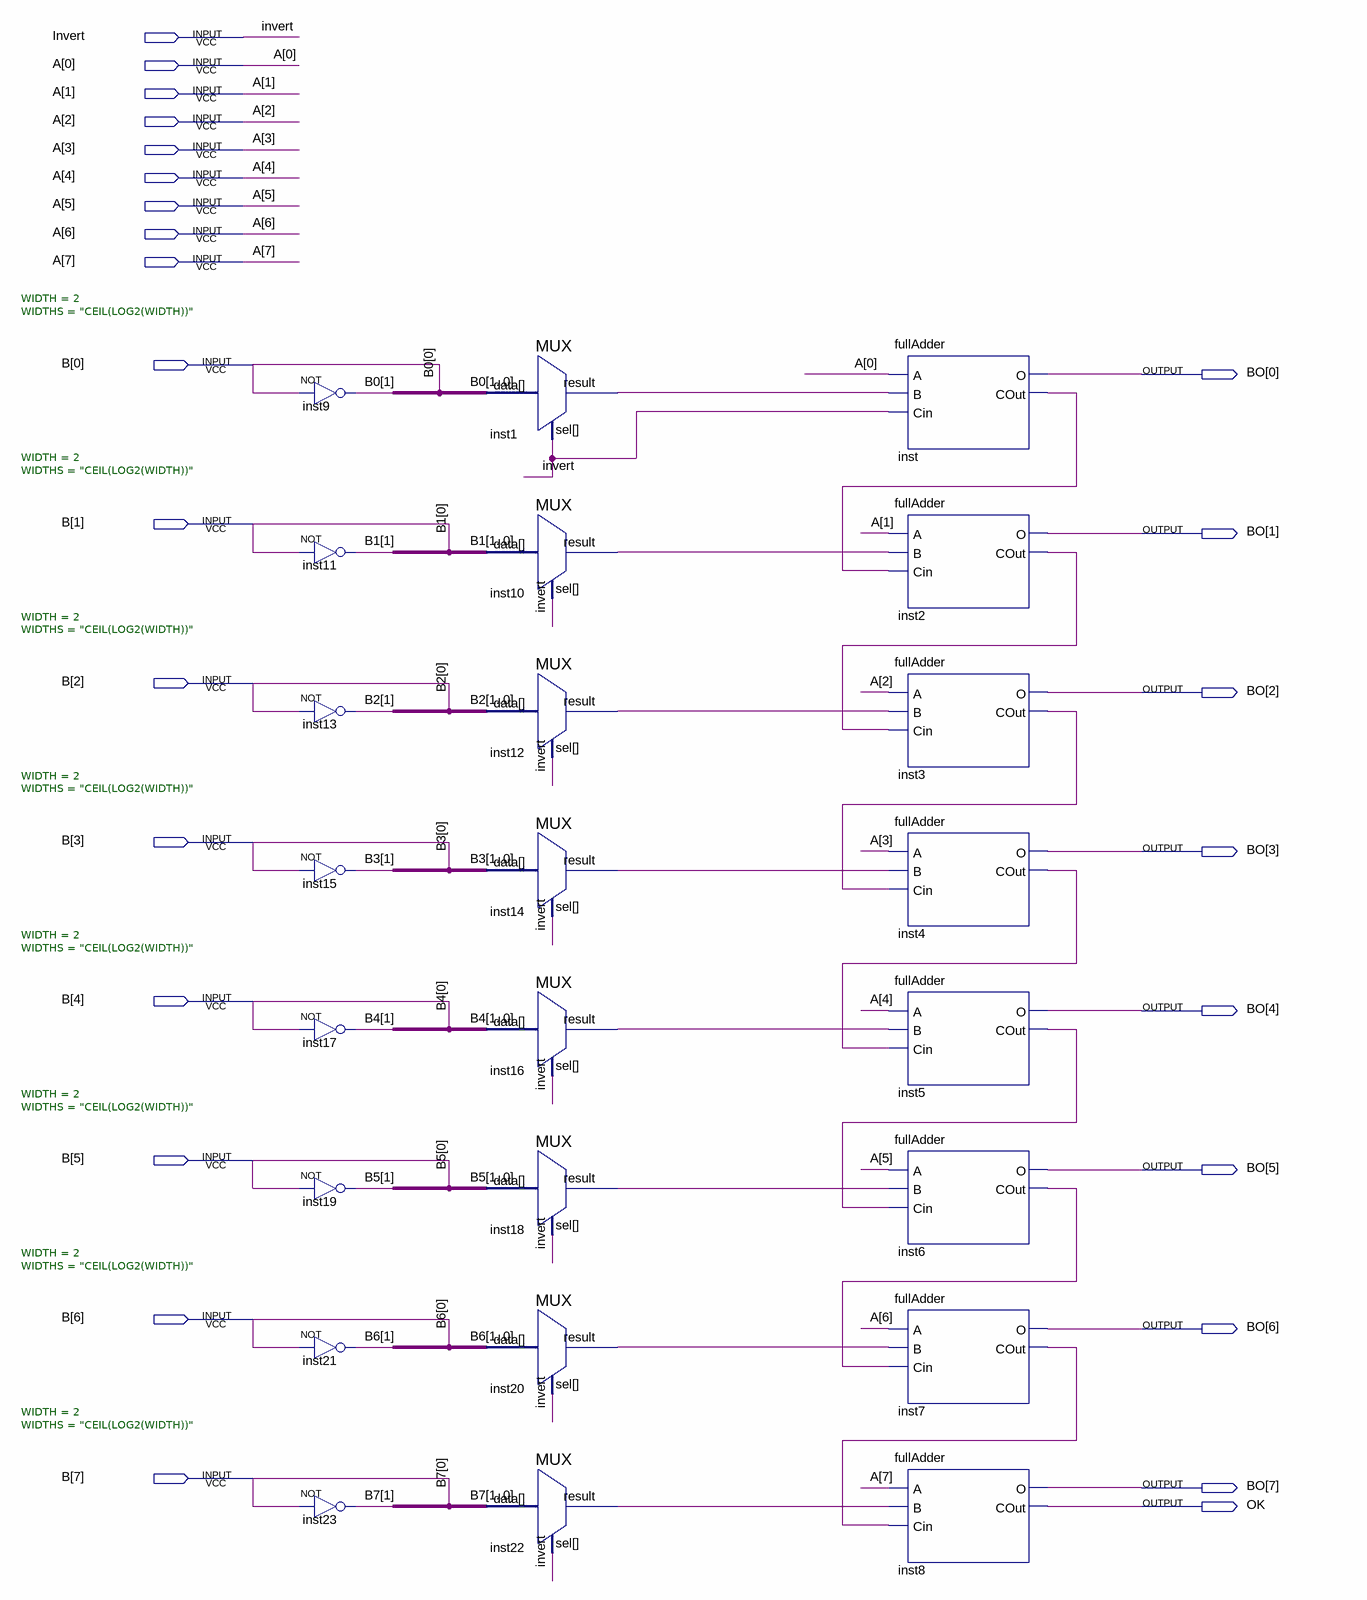
[diagram p0: schematic sheet]
// Quartus schematic ULA.bdf as structural Verilog: 24 symbols, 26 pins
module ULA (
  input  Invert,
  input  [7:0] A,
  input  [7:0] B,
  output [7:0] BO,
  output OK
);

  wire inst1_result, inst2_cout, inst3_cout, inst4_cout, inst5_cout, inst6_cout, inst7_cout, inst10_result,
       inst12_result, inst14_result, inst16_result, inst18_result, inst20_result, inst22_result, inst_cout;
  wire [1:1] B0, B1, B2, B3, B4, B5, B6, B7;

  not inst9 (B0[1], B[0]);
  not inst11 (B1[1], B[1]);
  not inst13 (B2[1], B[2]);
  not inst15 (B3[1], B[3]);
  not inst17 (B4[1], B[4]);
  not inst19 (B5[1], B[5]);
  not inst21 (B6[1], B[6]);
  not inst23 (B7[1], B[7]);
  MUX #(.WIDTH(2), .WIDTHS("CEIL(LOG2(WIDTH))")) inst1 (.data({B0[1], B[0]}), .sel(Invert), .result(inst1_result));
  MUX #(.WIDTH(2), .WIDTHS("CEIL(LOG2(WIDTH))")) inst10 (.data({B1[1], B[1]}), .sel(Invert), .result(inst10_result));
  MUX #(.WIDTH(2), .WIDTHS("CEIL(LOG2(WIDTH))")) inst12 (.data({B2[1], B[2]}), .sel(Invert), .result(inst12_result));
  MUX #(.WIDTH(2), .WIDTHS("CEIL(LOG2(WIDTH))")) inst14 (.data({B3[1], B[3]}), .sel(Invert), .result(inst14_result));
  MUX #(.WIDTH(2), .WIDTHS("CEIL(LOG2(WIDTH))")) inst16 (.data({B4[1], B[4]}), .sel(Invert), .result(inst16_result));
  MUX #(.WIDTH(2), .WIDTHS("CEIL(LOG2(WIDTH))")) inst18 (.data({B5[1], B[5]}), .sel(Invert), .result(inst18_result));
  MUX #(.WIDTH(2), .WIDTHS("CEIL(LOG2(WIDTH))")) inst20 (.data({B6[1], B[6]}), .sel(Invert), .result(inst20_result));
  MUX #(.WIDTH(2), .WIDTHS("CEIL(LOG2(WIDTH))")) inst22 (.data({B7[1], B[7]}), .sel(Invert), .result(inst22_result));
  fullAdder inst (.A(A[0]), .B(inst1_result), .Cin(Invert), .O(BO[0]), .COut(inst_cout));
  fullAdder inst2 (.A(A[1]), .B(inst10_result), .Cin(inst_cout), .O(BO[1]), .COut(inst2_cout));
  fullAdder inst3 (.A(A[2]), .B(inst12_result), .Cin(inst2_cout), .O(BO[2]), .COut(inst3_cout));
  fullAdder inst4 (.A(A[3]), .B(inst14_result), .Cin(inst3_cout), .O(BO[3]), .COut(inst4_cout));
  fullAdder inst5 (.A(A[4]), .B(inst16_result), .Cin(inst4_cout), .O(BO[4]), .COut(inst5_cout));
  fullAdder inst6 (.A(A[5]), .B(inst18_result), .Cin(inst5_cout), .O(BO[5]), .COut(inst6_cout));
  fullAdder inst7 (.A(A[6]), .B(inst20_result), .Cin(inst6_cout), .O(BO[6]), .COut(inst7_cout));
  fullAdder inst8 (.A(A[7]), .B(inst22_result), .Cin(inst7_cout), .O(BO[7]), .COut(OK));

  // Other names for the same wires on the sheet: B1[0] = B[1]; B2[0] = B[2]; B3[0] = B[3]; B4[0] = B[4]; B5[0] = B[5];
  //   B6[0] = B[6]; B7[0] = B[7]; B0[0] = B[0]
endmodule
